# Altium schematic sheet Encoder.SchDoc
size B; Author: E. Sims; Organization: Let's Build Rockets Inc.; SheetNumber: 18; SheetTotal: 18
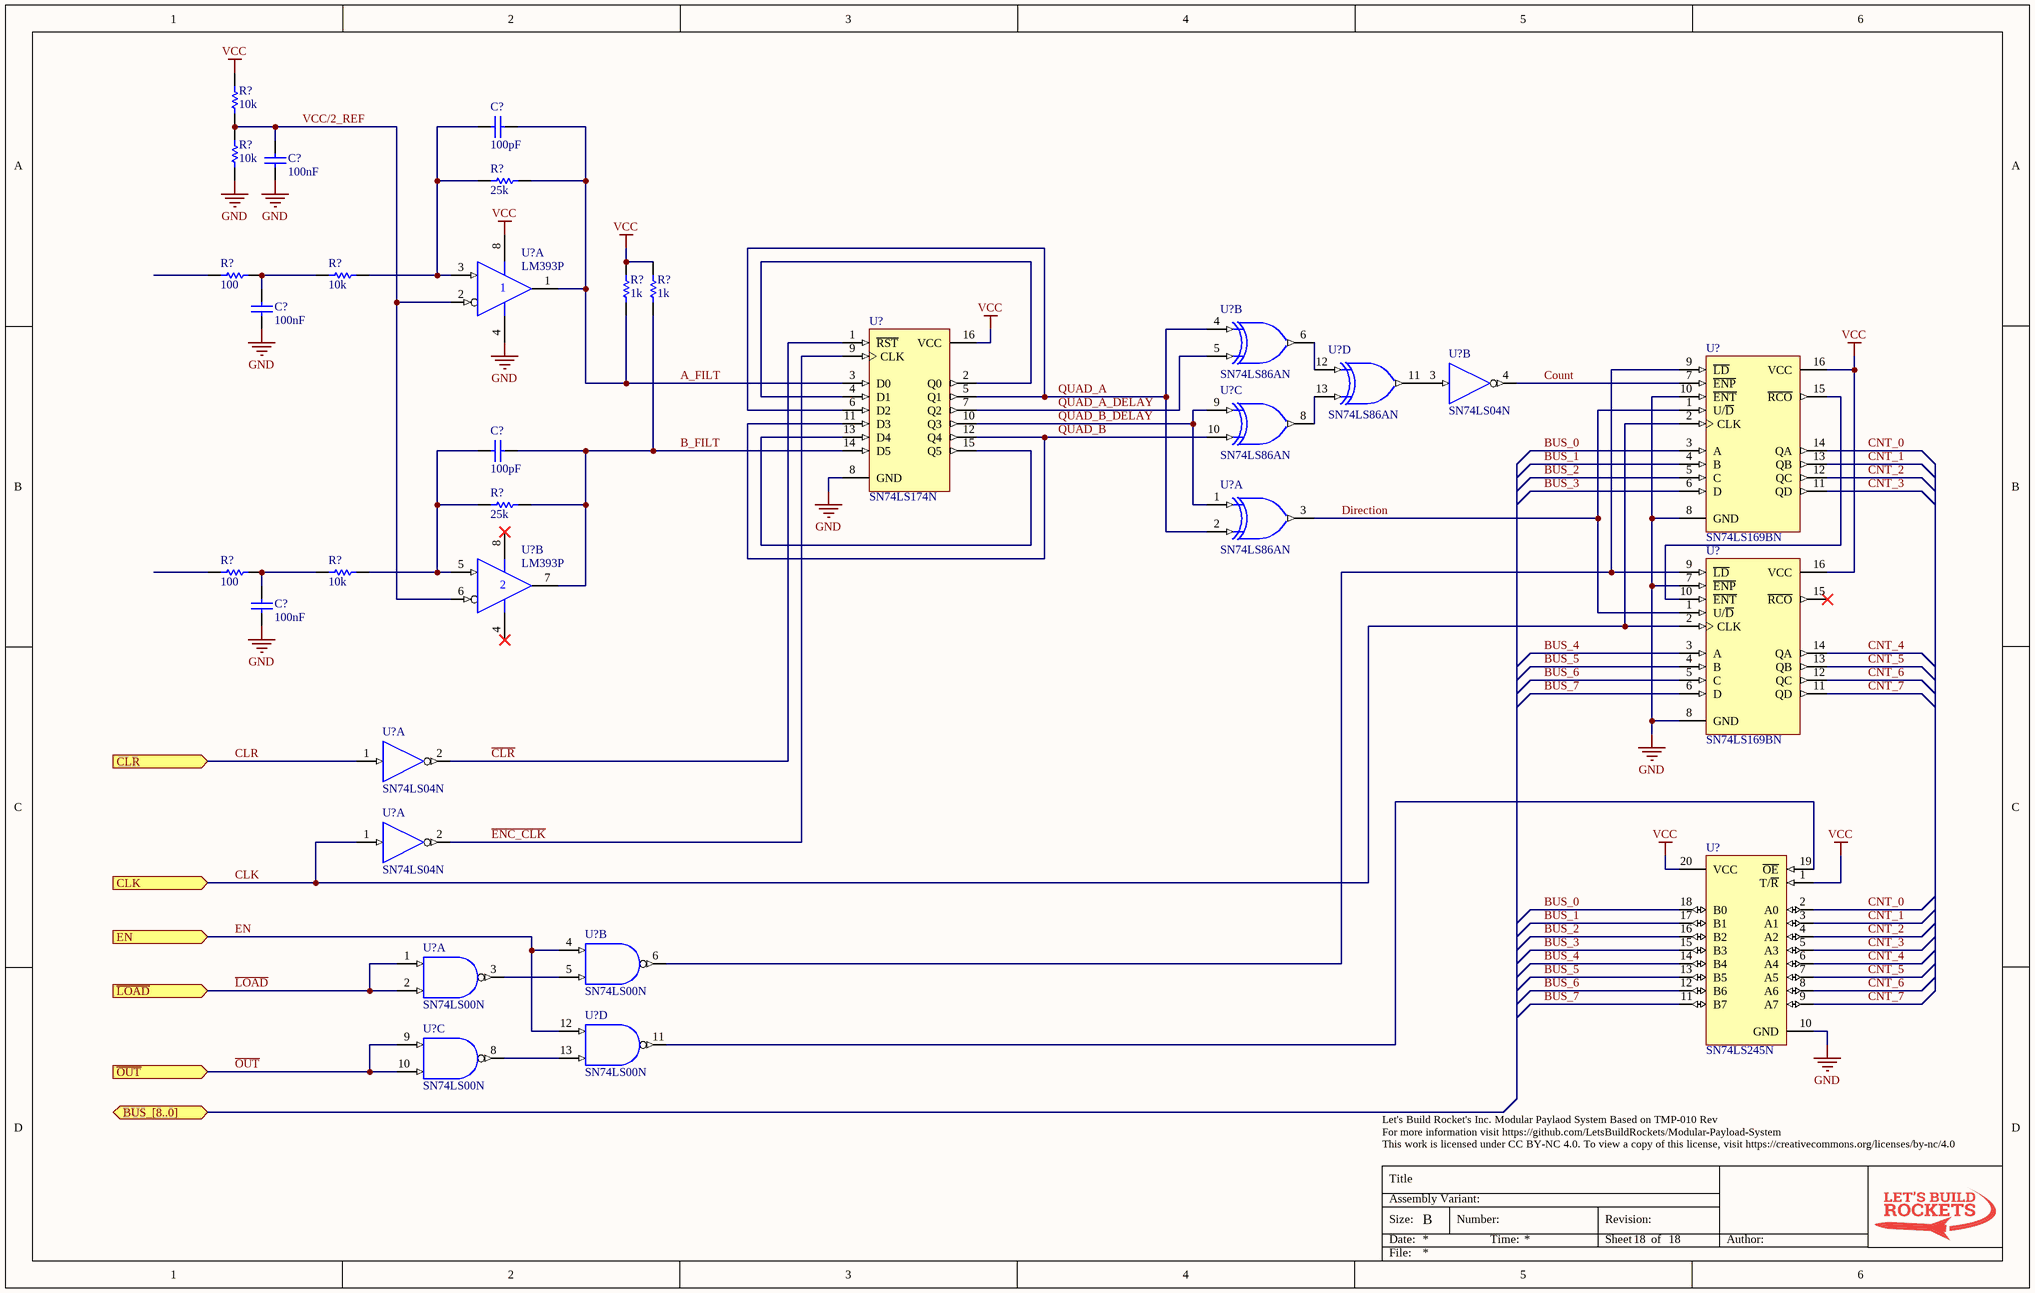
[diagram p0: Encoder.SchDoc]

## Parts
(Parts that share a designator on the sheet are numbered #1, #2 ... from top to bottom, then left to right.)
C?#1  value 100pF  [RAD-0.3]  (hidden comment: Cap)
C?#2  value 100nF  [RAD-0.3]  (hidden comment: Cap)
C?#3  value 100nF  [RAD-0.3]  (hidden comment: Cap)
C?#4  value 100pF  [RAD-0.3]  (hidden comment: Cap)
C?#5  value 100nF  [RAD-0.3]  (hidden comment: Cap)
R?#1  value 10k  [AXIAL-0.3]  (hidden comment: Res1)
R?#2  value 10k  [AXIAL-0.3]  (hidden comment: Res1)
R?#3  value 25k  [AXIAL-0.3]  (hidden comment: Res1)
R?#4  value 1k  [AXIAL-0.3]  (hidden comment: Res1)
R?#5  value 1k  [AXIAL-0.3]  (hidden comment: Res1)
R?#6  value 100  [AXIAL-0.3]  (hidden comment: Res1)
R?#7  value 10k  [AXIAL-0.3]  (hidden comment: Res1)
R?#8  value 25k  [AXIAL-0.3]  (hidden comment: Res1)
R?#9  value 100  [AXIAL-0.3]  (hidden comment: Res1)
R?#10  value 10k  [AXIAL-0.3]  (hidden comment: Res1)
U?#1  LM393P  [P008]  (part A of 2)
U?#2  SN74LS86AN  [N014]  (part B of 4)
U?#3  SN74LS174N  [N016]
U?#4  SN74LS86AN  [N014]  (part D of 4)
U?#5  SN74LS04N  [N014]  (part B of 6)
U?#6  SN74LS169BN  [N016]
U?#7  SN74LS86AN  [N014]  (part C of 4)
U?#8  SN74LS86AN  [N014]  (part A of 4)
U?#9  LM393P  [P008]  (part B of 2)
U?#10  SN74LS169BN  [N016]
U?#11  SN74LS04N  [N014]  (part A of 6)
U?#12  SN74LS04N  [N014]  (part A of 6)
U?#13  SN74LS245N  [N020]
U?#14  SN74LS00N  [N014]  (part B of 4)
U?#15  SN74LS00N  [N014]  (part A of 4)
U?#16  SN74LS00N  [N014]  (part D of 4)
U?#17  SN74LS00N  [N014]  (part C of 4)

## Ports
BUS_[8..0] (bidir), CLK (in), CLR (in), EN (in), ~{LOAD} (in), ~{OUT} (in)

## Nets
GND: C?#2.2 C?#3.2 C?#5.2 R?#2.2 U?#1.4(GND) U?#2.7(GND) U?#3.8(GND) U?#4.7(GND) U?#5.7(GND) U?#6.8(GND) U?#6.10(~{ENT}) U?#7.7(GND) U?#8.7(GND) U?#10.7(~{ENP}) U?#10.8(GND) U?#11.7(GND) U?#12.7(GND) U?#13.10(GND) U?#14.7(GND) U?#15.7(GND) U?#16.7(GND) U?#17.7(GND)
VCC: R?#1.1 R?#4.1 R?#5.1 U?#1.8(VCC) U?#2.14(VCC) U?#3.16(VCC) U?#4.14(VCC) U?#5.14(VCC) U?#6.16(VCC) U?#7.14(VCC) U?#8.14(VCC) U?#10.16(VCC) U?#11.14(VCC) U?#12.14(VCC) U?#13.1(T/~{R}) U?#13.20(VCC) U?#14.14(VCC) U?#15.14(VCC) U?#16.14(VCC) U?#17.14(VCC)
A_FILT: C?#1.1 R?#3.1 R?#4.2 U?#1.1(OUT) U?#3.3(D0)
B_FILT: C?#4.1 R?#5.2 R?#8.1 U?#3.14(D5) U?#9.7(OUT)
BUS_0: U?#6.3(A) U?#13.18(B0)
BUS_1: U?#6.4(B) U?#13.17(B1)
BUS_2: U?#6.5(C) U?#13.16(B2)
BUS_3: U?#6.6(D) U?#13.15(B3)
BUS_4: U?#10.3(A) U?#13.14(B4)
BUS_5: U?#10.4(B) U?#13.13(B5)
BUS_6: U?#10.5(C) U?#13.12(B6)
BUS_7: U?#10.6(D) U?#13.11(B7)
~{CLR}: U?#3.1(~{RST}) U?#11.2(Y)
CLK: U?#6.2(CLK) U?#10.2(CLK) U?#12.1(A) ; port CLK
CLR: U?#11.1(A) ; port CLR
CNT_0: U?#6.14(QA) U?#13.2(A0)
CNT_1: U?#6.13(QB) U?#13.3(A1)
CNT_2: U?#6.12(QC) U?#13.4(A2)
CNT_3: U?#6.11(QD) U?#13.5(A3)
CNT_4: U?#10.14(QA) U?#13.6(A4)
CNT_5: U?#10.13(QB) U?#13.7(A5)
CNT_6: U?#10.12(QC) U?#13.8(A6)
CNT_7: U?#10.11(QD) U?#13.9(A7)
Count: U?#5.4(Y) U?#6.7(~{ENP})
Direction: U?#6.1(U/~{D}) U?#8.3(Y) U?#10.1(U/~{D})
~{ENC_CLK}: U?#3.9(CLK) U?#12.2(Y)
EN: U?#14.4(A) U?#16.12(A) ; port EN
~{LOAD}: U?#15.1(A) U?#15.2(B) ; port ~{LOAD}
~{OUT}: U?#17.9(A) U?#17.10(B) ; port ~{OUT}
QUAD_A: U?#2.4(A) U?#3.5(Q1) U?#3.6(D2) U?#8.2(B)
QUAD_A_DELAY: U?#2.5(B) U?#3.7(Q2)
QUAD_B: U?#3.11(D3) U?#3.12(Q4) U?#7.10(B)
QUAD_B_DELAY: U?#3.10(Q3) U?#7.9(A) U?#8.1(A)
VCC/2_REF: C?#2.1 R?#1.2 R?#2.1 U?#1.2(IN-) U?#9.6(IN-)
NetC?#1_2: C?#1.2 R?#3.2 R?#7.1 U?#1.3(IN+)
NetC?#3_1: C?#3.1 R?#6.1 R?#7.2
NetC?#4_2: C?#4.2 R?#8.2 R?#10.1 U?#9.5(IN+)
NetC?#5_1: C?#5.1 R?#9.1 R?#10.2
NetU?#2_6: U?#2.6(Y) U?#4.12(A)
NetU?#3_2: U?#3.2(Q0) U?#3.4(D1)
NetU?#3_13: U?#3.13(D4) U?#3.15(Q5)
NetU?#4_11: U?#4.11(Y) U?#5.3(A)
NetU?#4_13: U?#4.13(B) U?#7.8(Y)
NetU?#6_9: U?#6.9(~{LD}) U?#10.9(~{LD}) U?#14.6(Y)
NetU?#6_15: U?#6.15(~{RCO}) U?#10.10(~{ENT})
NetU?#13_19: U?#13.19(~{OE}) U?#16.11(Y)
NetU?#14_5: U?#14.5(B) U?#15.3(Y)
NetU?#16_13: U?#16.13(B) U?#17.8(Y)

Not connected (* = marked no-connect by the designer): R?#6 2; R?#9 2; U?#9 4(GND)* 8(VCC)*; U?#10 15(~{RCO})*

## Notes on the sheet
- Let's Build Rocket's Inc. Modular Paylaod System Based on TMP-010 Rev
  For more information visit https://github.com/LetsBuildRockets/Modular-Payload-System
  This work is licensed under CC BY-NC 4.0. To view a copy of this license, visit https://creativecommons.org/licenses/by-nc/4.0
- Title
- Size:
- Date:
- Assembly Variant:
- B
- Number:
- Time:
- Revision:
- Sheet
- of
- Author:
- File:

## Library data of the parts
C?#1-C?#5 = Cap: Capacitor; Published: 8-Jun-2000; LatestRevisionDate: 17-Jul-2002; LatestRevisionNote: Re-released for DXP Platform.; PackageReference: RAD-0.3; Publisher: Altium Limited; PackageDescription: Radial Cap, Thru-Hole; 2 Leads; 0.3 in Pin Spacing
R?#1-R?#10 = Res1: Resistor; Published: 8-Jun-2000; LatestRevisionDate: 17-Jul-2002; LatestRevisionNote: Re-released for DXP Platform.; PackageReference: AXIAL-0.3; Publisher: Altium Limited; PackageDescription: Axial Device, Thru-Hole; 2 Leads; 0.3 in Pin Spacing
U?#1 U?#9 = LM393P: Dual Differential Comparator; Published: 15-Apr-2002; LatestRevisionDate: 04-Mar-2005; LatestRevisionNote: Stylized 3D Model Added.; DatasheetVersion: Nov-1988; PackageVersion: Jun-1999; PackageReference: P008; Publisher: Altium Limited; PackageDescription: DIP; 8 Leads; Row Spacing 7.62 mm; Pitch 2.54 mm; Code_JEDEC: MO-001-AN; ComponentLink1Description: Manufacturer Link; ComponentLink1URL: http://www.ti.com/; ComponentLink2Description: Datasheet; ComponentLink2URL: http://www-s.ti.com/sc/ds/lm193.pdf
U?#2 U?#4 U?#7 U?#8 = SN74LS86AN: Quadruple 2-Input Exclusive-OR Gate; Published: 8-Jun-2000; LatestRevisionDate: 04-Mar-2005; LatestRevisionNote: Stylized 3D Model Added.; DatasheetVersion: Mar-1988; PackageVersion: Oct-1995; PackageReference: N014; Publisher: Altium Limited; PackageDescription: DIP; 14 Leads; Row Spacing 7.62 mm; Pitch 2.54 mm; ComponentLink1Description: Manufacturer Link; ComponentLink1URL: http://www.ti.com/; ComponentLink2Description: Datasheet; ComponentLink2URL: http://www-s.ti.com/sc/ds/sn74ls86a.pdf
U?#3 = SN74LS174N: Hex D-Type Flip-Flop with Clear; Published: 8-Jun-2000; LatestRevisionDate: 04-Mar-2005; LatestRevisionNote: Stylized 3D Model Added.; DatasheetVersion: Mar-1988; PackageVersion: Oct-1995; PackageReference: N016; Publisher: Altium Limited; PackageDescription: DIP; 16 Leads; Row Spacing 7.62 mm; Pitch 2.54 mm; Code_JEDEC: MS-001-BB; ComponentLink1Description: Manufacturer Link; ComponentLink1URL: http://www.ti.com/; ComponentLink2Description: Datasheet; ComponentLink2URL: http://www-s.ti.com/sc/ds/sn74175.pdf
U?#5 U?#11 U?#12 = SN74LS04N: Hex Inverter; Published: 8-Jun-2000; LatestRevisionDate: 04-Mar-2005; LatestRevisionNote: Stylized 3D Model Added.; DatasheetVersion: Mar-1988; PackageVersion: Oct-1995; PackageReference: N014; Publisher: Altium Limited; PackageDescription: DIP; 14 Leads; Row Spacing 7.62 mm; Pitch 2.54 mm; ComponentLink1Description: Manufacturer Link; ComponentLink1URL: http://www.ti.com/; ComponentLink2Description: Datasheet; ComponentLink2URL: http://www-s.ti.com/sc/ds/sn74ls04.pdf
U?#6 U?#10 = SN74LS169BN: Synchronous 4-Bit Up/Down Binary Counter; Published: 8-Jun-2000; LatestRevisionDate: 04-Mar-2005; LatestRevisionNote: Stylized 3D Model Added.; DatasheetVersion: Mar-1988; PackageVersion: Oct-1995; PackageReference: N016; Publisher: Altium Limited; PackageDescription: DIP; 16 Leads; Row Spacing 7.62 mm; Pitch 2.54 mm; Code_JEDEC: MS-001-BB; ComponentLink1Description: Manufacturer Link; ComponentLink1URL: http://www.ti.com/; ComponentLink2Description: Datasheet; ComponentLink2URL: http://www-s.ti.com/sc/ds/sn74ls169b.pdf
U?#13 = SN74LS245N: Octal Bus Transceiver with 3-State Outputs; Published: 8-Jun-2000; LatestRevisionDate: 04-Mar-2005; LatestRevisionNote: Stylized 3D Model Added.; DatasheetVersion: Mar-1988; PackageVersion: Oct-1995; PackageReference: N020; Publisher: Altium Limited; PackageDescription: DIP; 20 Leads; Row Spacing 7.62 mm; Pitch 2.54 mm; ComponentLink1Description: Manufacturer Link; ComponentLink1URL: http://www.ti.com/; ComponentLink2Description: Datasheet; ComponentLink2URL: http://www-s.ti.com/sc/ds/sn74ls245.pdf
U?#14-U?#17 = SN74LS00N: Quadruple 2-Input Positive-NAND Gate; Published: 8-Jun-2000; LatestRevisionDate: 04-Mar-2005; LatestRevisionNote: Stylized 3D Model Added.; DatasheetVersion: Mar-1988; PackageVersion: Oct-1995; PackageReference: N014; Publisher: Altium Limited; PackageDescription: DIP; 14 Leads; Row Spacing 7.62 mm; Pitch 2.54 mm; ComponentLink1Description: Manufacturer Link; ComponentLink1URL: http://www.ti.com/; ComponentLink2Description: Datasheet; ComponentLink2URL: http://www-s.ti.com/sc/ds/sn74ls00.pdf